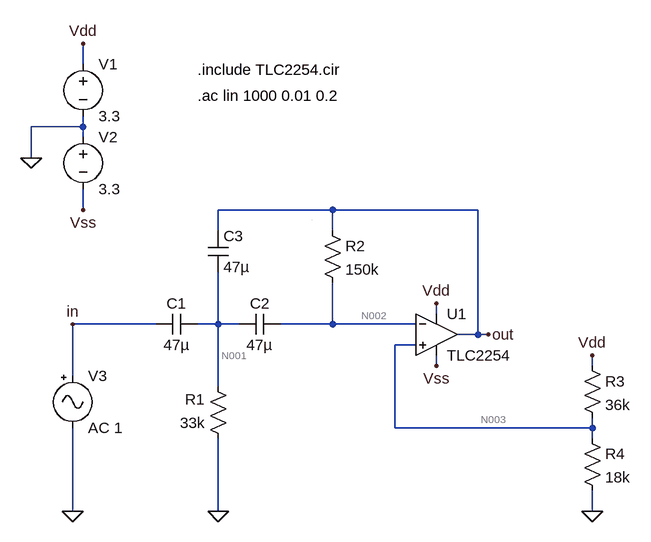
[diagram p0: schematic passa_altas_mfb_2_ordem.asc]
passa_altas_mfb_2_ordem.asc, the LTspice schematic file:
Version 4
SHEET 1 880 680
WIRE -352 -240 -352 -272
WIRE -352 -144 -352 -160
WIRE -352 -144 -432 -144
WIRE -352 -128 -352 -144
WIRE -432 -96 -432 -144
WIRE -352 -16 -352 -48
WIRE 32 -16 -144 -16
WIRE 256 -16 32 -16
WIRE -144 16 -144 -16
WIRE 32 16 32 -16
WIRE 192 144 192 128
WIRE -240 160 -368 160
WIRE -144 160 -144 80
WIRE -144 160 -176 160
WIRE -112 160 -144 160
WIRE 32 160 32 96
WIRE 32 160 -48 160
WIRE 160 160 32 160
WIRE 256 176 256 -16
WIRE 256 176 224 176
WIRE 272 176 256 176
WIRE 160 192 128 192
WIRE 192 224 192 208
WIRE 432 224 432 208
WIRE -368 240 -368 160
WIRE -144 256 -144 160
WIRE 128 320 128 192
WIRE 432 320 432 304
WIRE 432 320 128 320
WIRE 432 336 432 320
WIRE -368 448 -368 320
WIRE -144 448 -144 336
WIRE 432 448 432 416
WIRE 0 0 0 0
FLAG -144 448 0
FLAG -432 -96 0
FLAG -352 -272 Vdd
FLAG 192 128 Vdd
FLAG 192 224 Vss
FLAG -352 -16 Vss
FLAG -368 448 0
FLAG -368 160 in
FLAG 272 176 out
FLAG 432 448 0
FLAG 432 208 Vdd
SYMBOL Opamps\\TLC2254 192 112 R0
SYMATTR InstName U1
SYMATTR SpiceModel TLC2254
SYMBOL res -128 352 R180
WINDOW 0 36 76 Left 2
WINDOW 3 36 40 Left 2
SYMATTR InstName R1
SYMATTR Value 33k
SYMBOL res 16 0 R0
SYMATTR InstName R2
SYMATTR Value 150k
SYMBOL cap -176 144 R90
WINDOW 0 0 32 VBottom 2
WINDOW 3 32 32 VTop 2
SYMATTR InstName C1
SYMATTR Value 47µ
SYMBOL cap -48 144 R90
WINDOW 0 0 32 VBottom 2
WINDOW 3 32 32 VTop 2
SYMATTR InstName C2
SYMATTR Value 47µ
SYMBOL voltage -352 -256 R0
SYMATTR InstName V1
SYMATTR Value 3.3
SYMBOL voltage -352 -144 R0
SYMATTR InstName V2
SYMATTR Value 3.3
SYMBOL Misc\\signal -368 224 R0
WINDOW 123 0 0 Left 2
WINDOW 39 0 0 Left 2
SYMATTR InstName V3
SYMATTR Value AC 1
SYMBOL cap -160 16 R0
SYMATTR InstName C3
SYMATTR Value 47µ
SYMBOL res 416 208 R0
SYMATTR InstName R3
SYMATTR Value 36k
SYMBOL res 416 320 R0
SYMATTR InstName R4
SYMATTR Value 18k
TEXT -176 -192 Left 2 !.ac lin 1000 0.01 0.2
TEXT -176 -232 Left 2 !.include TLC2254.cir

The netlist it stands for:
* passa_altas_mfb_2_ordem.asc
XU1 N003 N002 Vdd Vss out TLC2254 TLC2254  ; pins In+ In- V+ V- OUT
R1 0 N001 33k
R2 out N002 150k
C1 N001 in 47µ
C2 N002 N001 47µ
V1 Vdd 0 3.3
V2 0 Vss 3.3
V3 in 0 AC 1
C3 out N001 47µ
R3 Vdd N003 36k
R4 N003 0 18k
.ac lin 1000 0.01 0.2
.include TLC2254.cir
.backanno
.end

* Results of the author's LTspice run, read from the files saved beside the schematic
* Operating Point, zero values left out:
*   V(out) = 1.1 V
*   V(vss) = -3.3 V
*   V(vdd) = 3.3 V
*   V(n002) = 1.1 V
*   V(n003) = 1.1 V
*   I(R4) = 61.11 µA
*   I(R3) = 61.11 µA
*   I(R2) = 1.538 pA
*   I(V2) = -95.48 µA
*   I(V1) = -156.6 µA
*   Ix(u1:1) = 1.557 pA
*   Ix(u1:2) = 1.537 pA
*   Ix(u1:3) = 95.5 µA
*   Ix(u1:4) = -95.48 µA
*   Ix(u1:5) = -1.538 pA
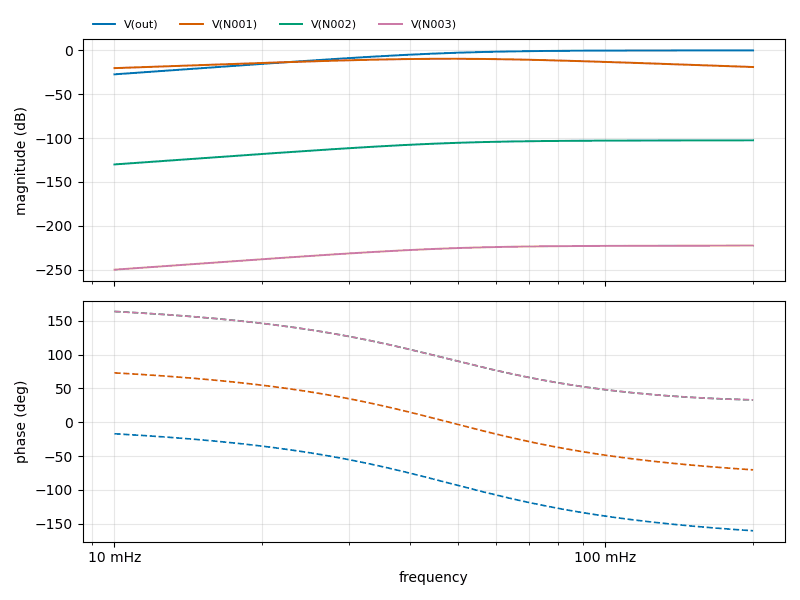
[diagram p1: AC Analysis of passa_altas_mfb_2_ordem.asc, plotted from the saved traces]
* AC Analysis, 1 run:
*   V(out): -27.30 dB at 10 mHz, -0.01 dB at 200 mHz, peak -0.01 dB at 200 mHz, 3 dB below the peak at 47.84 mHz
*   V(N001): -20.23 dB at 10 mHz, -18.96 dB at 200 mHz, peak -9.54 dB at 48.04 mHz, 3 dB below the peak at 24.99 mHz and 92.71 mHz
*   V(N002): -130.06 dB at 10 mHz, -102.54 dB at 200 mHz, peak -102.54 dB at 200 mHz, 3 dB below the peak at 49.06 mHz
*   V(N003): -250.11 dB at 10 mHz, -222.59 dB at 200 mHz, peak -222.59 dB at 200 mHz, 3 dB below the peak at 49.06 mHz